# Altium schematic sheet AyaNeoRear_V1.SchDoc
size B; SheetNumber: 1; SheetTotal: 1
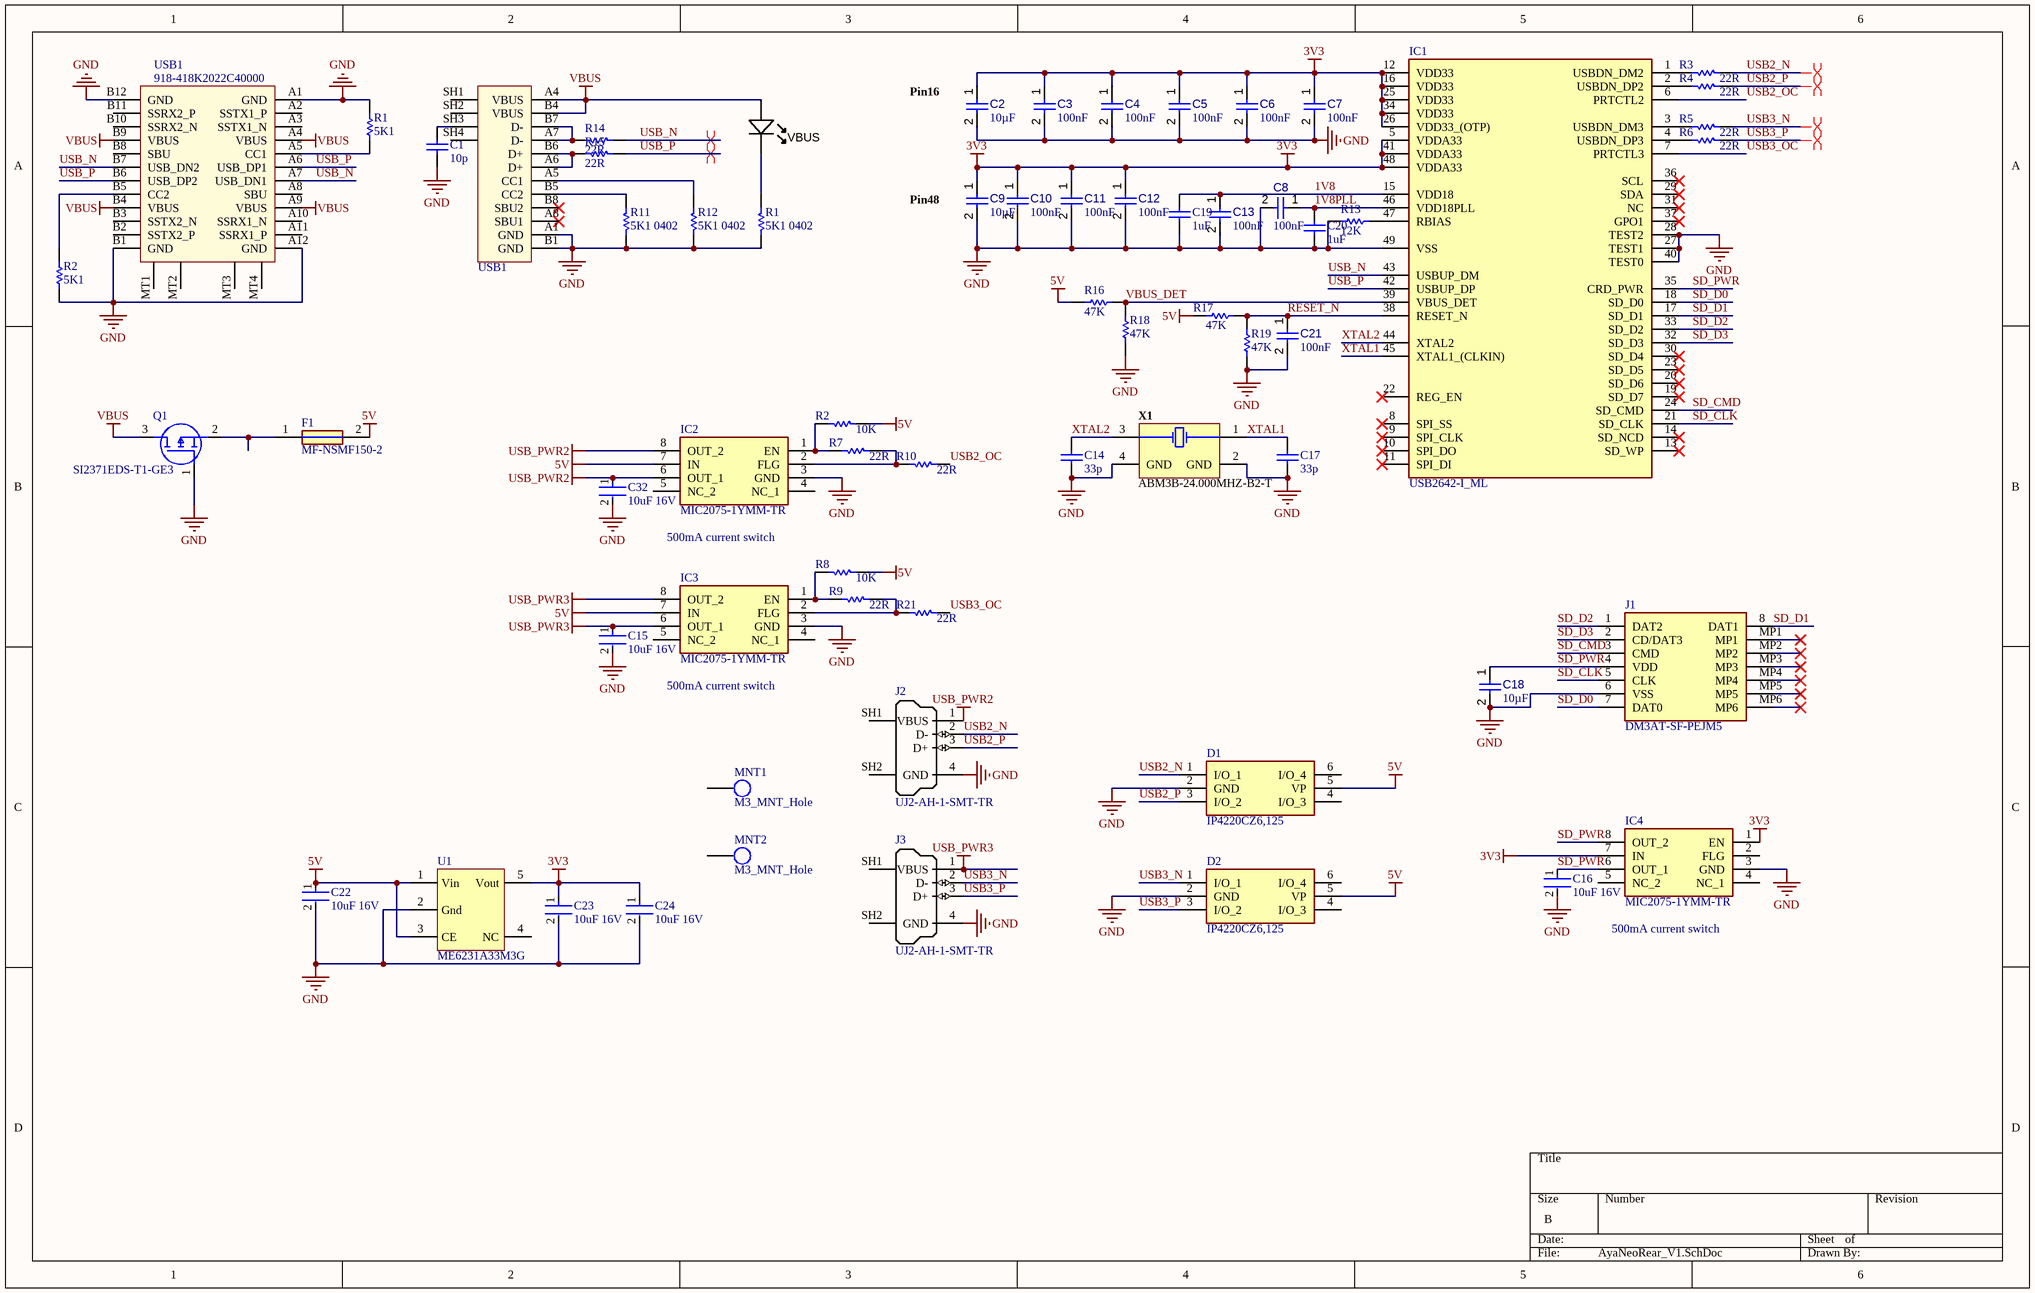
[diagram p0: AyaNeoRear_V1.SchDoc]

## Parts
(Parts that share a designator on the sheet are numbered #1, #2 ... from top to bottom, then left to right.)
C1  10p  [CAPC1005X56X25ML10T15]
C2  value 10µF  [CAPC0603(1608)100_L]  (hidden comment: Capacitor 10µF +/-20% 10V 0603)
C3  value 100nF  [CAPC1005X56X25ML10T15]  (hidden comment: Capacitor 0.1 uF +/- 5% 16 V 0402)
C4  value 100nF  [CAPC1005X56X25ML10T15]  (hidden comment: Capacitor 0.1 uF +/- 5% 16 V 0402)
C5  value 100nF  [CAPC1005X56X25ML10T15]  (hidden comment: Capacitor 0.1 uF +/- 5% 16 V 0402)
C6  value 100nF  [CAPC1005X56X25ML10T15]  (hidden comment: Capacitor 0.1 uF +/- 5% 16 V 0402)
C7  value 100nF  [CAPC1005X56X25ML10T15]  (hidden comment: Capacitor 0.1 uF +/- 5% 16 V 0402)
C8  value 100nF  [CAPC1005X56X25ML10T15]  (hidden comment: Capacitor 0.1 uF +/- 5% 16 V 0402)
C9  value 10µF  [CAPC0603(1608)100_L]  (hidden comment: Capacitor 10µF +/-20% 10V 0603)
C10  value 100nF  [CAPC1005X56X25ML10T15]  (hidden comment: Capacitor 0.1 uF +/- 5% 16 V 0402)
C11  value 100nF  [CAPC1005X56X25ML10T15]  (hidden comment: Capacitor 0.1 uF +/- 5% 16 V 0402)
C12  value 100nF  [CAPC1005X56X25ML10T15]  (hidden comment: Capacitor 0.1 uF +/- 5% 16 V 0402)
C13  value 100nF  [CAPC1005X56X25ML10T15]  (hidden comment: Capacitor 0.1 uF +/- 5% 16 V 0402)
C14  33p  [CAPC1005X56X25ML10T15]
C15  10uF 16V  [FP-CL21-IPC_B]
C16  10uF 16V  [FP-CL21-IPC_B]
C17  33p  [CAPC1005X56X25ML10T15]
C18  value 10µF  [CAPC0603(1608)100_L]  (hidden comment: Capacitor 10µF +/-20% 10V 0603)
C19  1uF  [CAPC1608X90N]
C20  1uF  [CAPC1608X90N]
C21  value 100nF  [CAPC1005X56X25ML10T15]  (hidden comment: Capacitor 0.1 uF +/- 5% 16 V 0402)
C22  10uF 16V  [FP-CL21-IPC_B]
C23  10uF 16V  [FP-CL21-IPC_B]
C24  10uF 16V  [FP-CL21-IPC_B]
C32  10uF 16V  [FP-CL21-IPC_B]
D1  IP4220CZ6,125  [SOT95P275X110-6N]
D2  IP4220CZ6,125  [SOT95P275X110-6N]
F1  MF-NSMF150-2  [FUSC3216X70N]
IC1  USB2642-I_ML  [QFN50P700X700X100-49N-D]
IC2  MIC2075-1YMM-TR  [SOP65P490X110-8N]
IC3  MIC2075-1YMM-TR  [SOP65P490X110-8N]
IC4  MIC2075-1YMM-TR  [SOP65P490X110-8N]
J1  DM3AT-SF-PEJM5  [DM3ATSFPEJM5]
J2  UJ2-AH-1-SMT-TR  [UJ2-AH-1-SMT-TR]
J3  UJ2-AH-1-SMT-TR  [UJ2-AH-1-SMT-TR]
MNT1  M3_MNT_Hole  [M3_MNT_Hole]
MNT2  M3_MNT_Hole  [M3_MNT_Hole]
Q1  SI2371EDS-T1-GE3  [SOT95P237X112-3N]
R1#1  5K1  [RESC1005X40X25ML05T10]  (graphical)
R1#2  5K1 0402  [RESC1005X40X25ML05T05]
R2#1  5K1  [RESC1005X40X25ML05T10]  (graphical)
R2#2  10K  [RESC1005X40X25NL05T05]
R3  22R  [RESC1005X40X25ML05T05]
R4  22R  [RESC1005X40X25ML05T05]
R5  22R  [RESC1005X40X25ML05T05]
R6  22R  [RESC1005X40X25ML05T05]
R7  22R  [RESC1005X40X25ML05T05]
R8  10K  [RESC1005X40X25NL05T05]
R9  22R  [RESC1005X40X25ML05T05]
R10  22R  [RESC1005X40X25ML05T05]
R11  5K1 0402  [RESC1005X40X25ML05T05]
R12  5K1 0402  [RESC1005X40X25ML05T05]
R13  12K  [RESC1005X40X25NL05T05]
R14  22R  [RESC1005X40X25ML05T05]
R15  22R  [RESC1005X40X25ML05T05]
R16  47K  [RESC1005X40X25ML05T10]
R17  47K  [RESC1005X40X25ML05T10]
R18  47K  [RESC1005X40X25ML05T10]
R19  47K  [RESC1005X40X25ML05T10]
R21  22R  [RESC1005X40X25ML05T05]
U1  ME6231A33M3G  [SOT23-5]
USB1#1  USB type C connector  [TYPE-C-31-M-12]  (value not drawn)
USB1#2  918-418K2022C40000  [USB-Type-C 24 contact SMD+THD]  (graphical)
VBUS  LED_Green_GullWing  [LED-0805-A]  (value not drawn)
X1  ABM3B-24.000MHZ-B2-T  [ABRA-ABM3B-4_V]

## Nets
3V3: C2.1 C3.1 C4.1 C5.1 C6.1 C7.1 C9.1 C10.1 C11.1 C12.1 C23.1 C24.1 IC1.5(VDDA33) IC1.12(VDD33) IC1.16(VDD33) IC1.25(VDD33) IC1.26(VDD33_(OTP)) IC1.34(VDD33) IC1.41(VDDA33) IC1.48(VDDA33) IC4.1(EN) IC4.7(IN) U1.5(Vout)
5V: C22.1 D1.5(VP) D2.5(VP) F1.2 IC2.7(IN) IC3.7(IN) R2#2.2 R8.2 R16.2 R17.2 U1.1(Vin) U1.3(CE)
GND: C1.1 C2.2 C3.2 C4.2 C5.2 C6.2 C7.2 C8.2 C9.2 C10.2 C11.2 C12.2 C13.2 C14.2 C15.2 C16.2 C17.2 C18.2 C19.2 C20.2 C21.2 C22.2 C23.2 C24.2 C32.2 D1.2(GND) D2.2(GND) IC1.27(TEST1) IC1.28(TEST2) IC1.40(TEST0) IC1.49(VSS) IC2.3(GND) IC3.3(GND) IC4.3(GND) J1.6(VSS) J2.4(GND) J3.4(GND) Q1.1(G) R1#1.2 R1#2.1 R2#1.1 R11.1 R12.1 R13.2 R18.1 R19.1 U1.2(Gnd) USB1#1.A1(GND) USB1#1.B1(GND) USB1#2.A1(GND) USB1#2.A12(GND) USB1#2.B1(GND) USB1#2.B12(GND) X1.2(GND) X1.4(GND)
USB_PWR2: C32.1 IC2.6(OUT_1) IC2.8(OUT_2) J2.1(VBUS)
USB_PWR3: C15.1 IC3.6(OUT_1) IC3.8(OUT_2) J3.1(VBUS)
VBUS: Q1.3(D) USB1#1.A4(VBUS) USB1#1.B4(VBUS) USB1#2.A4(VBUS) USB1#2.A9(VBUS) USB1#2.B4(VBUS) USB1#2.B9(VBUS) VBUS.A
1V8: C13.1 C19.1 IC1.15(VDD18)
1V8PLL: C8.1 C20.1 IC1.46(VDD18PLL)
RESET_N: C21.1 IC1.38(RESET_N) R17.1 R19.2
SD_CLK: IC1.21(SD_CLK) J1.5(CLK)
SD_CMD: IC1.24(SD_CMD) J1.3(CMD)
SD_D0: IC1.18(SD_D0) J1.7(DAT0)
SD_D1: IC1.17(SD_D1) J1.8(DAT1)
SD_D2: IC1.33(SD_D2) J1.1(DAT2)
SD_D3: IC1.32(SD_D3) J1.2(CD/DAT3)
SD_PWR: C16.1 C18.1 IC1.35(CRD_PWR) IC4.6(OUT_1) IC4.8(OUT_2) J1.4(VDD)
USB2_N: D1.1(I/O_1) J2.2(D-) R3.1
USB2_OC: IC1.6(PRTCTL2) R10.1
USB2_P: D1.3(I/O_2) J2.3(D+) R4.1
USB3_N: D2.1(I/O_1) J3.2(D-) R5.1
USB3_OC: IC1.7(PRTCTL3) R21.1
USB3_P: D2.3(I/O_2) J3.3(D+) R6.1
USB_N: IC1.43(USBUP_DM) R14.1 USB1#2.A7(USB_DN1) USB1#2.B7(USB_DN2)
USB_P: IC1.42(USBUP_DP) R15.1 USB1#2.A6(USB_DP1) USB1#2.B6(USB_DP2)
VBUS_DET: IC1.39(VBUS_DET) R16.1 R18.2
XTAL1: C17.1 IC1.45(XTAL1_(CLKIN)) X1.1(X1)
XTAL2: C14.1 IC1.44(XTAL2) X1.3(X2)
NetC1_2: C1.2 USB1#1.SH3
NetF1_1: F1.1 Q1.2(S)
NetIC1_1: IC1.1(USBDN_DM2) R3.2
NetIC1_2: IC1.2(USBDN_DP2) R4.2
NetIC1_3: IC1.3(USBDN_DM3) R5.2
NetIC1_4: IC1.4(USBDN_DP3) R6.2
NetIC1_47: IC1.47(RBIAS) R13.1
NetIC2_1: IC2.1(EN) R2#2.1 R7.2
NetIC2_2: IC2.2(FLG) R7.1 R10.2
NetIC3_1: IC3.1(EN) R8.1 R9.2
NetIC3_2: IC3.2(FLG) R9.1 R21.2
NetR1#1_1: R1#1.1 USB1#2.A5(CC1)
NetR1#2_2: R1#2.2 VBUS.K
NetR2#1_2: R2#1.2 USB1#2.B5(CC2)
NetR11_2: R11.2 USB1#1.B5(CC2)
NetR12_2: R12.2 USB1#1.A5(CC1)
NetR14_2: R14.2 USB1#1.A7(D-) USB1#1.B7(D-)
NetR15_2: R15.2 USB1#1.A6(D+) USB1#1.B6(D+)

Not connected (* = marked no-connect by the designer): D1 4(I/O_3) 6(I/O_4); D2 4(I/O_3) 6(I/O_4); IC1 8(SPI_SS)* 9(SPI_CLK)* 10(SPI_DO)* 11(SPI_DI)* 13(SD_WP)* 14(SD_NCD)* 19(SD_D7)* 20(SD_D6)* 22(REG_EN)* 23(SD_D5)* 29(SDA)* 30(SD_D4)* 31(NC)* 36(SCL)* 37(GPO1)*; IC2 4(NC_1) 5(NC_2); IC3 4(NC_1) 5(NC_2); IC4 2(FLG) 4(NC_1) 5(NC_2); J1 MP1* MP2* MP3* MP4* MP5* MP6*; J2 SH1(Shell) SH2(Shell); J3 SH1(Shell) SH2(Shell); MNT1 1; MNT2 1; U1 4(NC); USB1#1 A8(SBU1)* B8(SBU2)* SH1 SH2 SH4; USB1#2 A2(SSTX1_P) A3(SSTX1_N) A8(SBU) A10(SSRX1_N) A11(SSRX1_P) B2(SSTX2_P) B3(SSTX2_N) B8(SBU) B10(SSRX2_N) B11(SSRX2_P) MT1 MT2 MT3 MT4

## Layout directives
differential pair: USB2_N, USB2_P, USB3_N, USB3_P, USB_N, USB_P

## Notes on the sheet
- (near C2) Pin16
- (near C9) Pin48
- 500mA current switch

## Library data of the parts
C1 = CMP-2008-02565-1: Manufacturer: AVX Interconnect / Elco; Part Number: 04025A100JAT2A
C2 C9 C18 = CMP-001-00075-2: Chip Capacitor, 10µF +/-20%, 10V, 0603, Thickness 1 mm; Tolerance: 10%; Mounting Technology: SMT; Pins: 2; Min Operating Temperature: -55°C; Case/Package: 0402; Max Operating Temperature: 85°C; Voltage Rating: 10V
C3-C8 C10-C13 C21 = CMP-001-00001-4: Chip Capacitor, 0.1 uF, +/- 5%, 16 V, 0402 (1005 Metric); Voltage Rating: 16V; Capacitor Type: Ceramic; Pins: 2; Min Operating Temperature: -55°C; Mounting Technology: SM; Max Operating Temperature: 125°C; RoHS Compliant: True; Case/Package: 0402; Tolerance: 5%
C14 C17 = CMP-2008-02637-1: 04025A330JAT2A; Manufacturer: AVX Interconnect / Elco; Part Number: 04025A330JAT2A
C15 C16 C22-C24 C32 = CMP-2000-06102-2: CL21 Series 0805 10uF 16V ±10% Tolerance X5R Multilayer Ceramic Chip Capacitor / CL21A106KOQNNNE; Dielectric: X7R; Length: 2mm; Depth: 1.25mm; Voltage: 16V; Width: 0.049inch; Capacitance: 10uF; Lead Free: Lead Free; Max Operating Temperature: 85°C; Mount: Surface Mount; Voltage Rating: 16V; Height: 1.25mm; Radiation Hardening: No; Packaging: Tape and Reel; Voltage Rating (DC): 16V; Thickness: 0.055inch; Case/Package: 0805; Case Code (Imperial): 0805; Min Operating Temperature: -55°C; Case Code (Metric): 2012; Package Quantity: 1; Tolerance: 10%
C19 C20 = GMK107BJ105KA-T: CAP CER 0603 1uF 35V X5R 10%; Value: 1u; Price per 100 unit (LCSC): US$0.0108
D1 D2 = IP4220CZ6,125: Diode; Manufacturer_Name: Nexperia; Datasheet Link: https://assets.nexperia.com/documents/data-sheet/IP4220CZ6.pdf; Height: 1.1mm; Manufacturer_Part_Number: IP4220CZ6,125; Mouser Part Number: 771-IP4220CZ6-T/R; Mouser Price/Stock: https://www.mouser.co.uk/ProductDetail/Nexperia/IP4220CZ6125?qs=me8TqzrmIYWNWIOv4%2FpxMw%3D%3D; Arrow Part Number: IP4220CZ6,125; Arrow Price/Stock: https://www.arrow.com/en/products/ip4220cz6125/nexperia?region=nac
F1 = MF-NSMF150-2: Fuse; Manufacturer_Name: Bourns; Datasheet Link: https://componentsearchengine.com/Datasheets/2/MF-NSMF150-2.pdf; Height: 0.7mm; Manufacturer_Part_Number: MF-NSMF150-2; Mouser Part Number: 652-MF-NSMF150-2; Mouser Price/Stock: https://www.mouser.co.uk/ProductDetail/Bourns/MF-NSMF150-2?qs=7D1gp7DixNnY7uwZYOi52Q%3D%3D; Arrow Part Number: MF-NSMF150-2; Arrow Price/Stock: https://www.arrow.com/en/products/mf-nsmf150-2/bourns?region=nac
IC1 = USB2642-I_ML: Integrated Circuit; Manufacturer_Name: Microchip; Manufacturer_Part_Number: USB2642-I/ML; Datasheet Link: https://www.arrow.com/en/products/usb2642-iml/microchip-technology; Height: 1mm; Mouser Part Number: 579-USB2642-I/ML; Mouser Price/Stock: https://www.mouser.co.uk/ProductDetail/Microchip-Technology/USB2642-I-ML?qs=QaDcGzfVzPPIqPyBH4Ei1Q%3D%3D; Arrow Part Number: USB2642-I/ML; Arrow Price/Stock: https://www.arrow.com/en/products/usb2642-iml/microchip-technology
IC2-IC4 = MIC2075-1YMM-TR: Integrated Circuit; Manufacturer_Name: Microchip; Datasheet Link: https://www.mouser.com/datasheet/2/268/mic2025-779052.pdf; Height: 1.1mm; Manufacturer_Part_Number: MIC2075-1YMM-TR; Mouser Part Number: 998-MIC2075-1YMMTR; Mouser Price/Stock: https://www.mouser.co.uk/ProductDetail/Microchip-Technology-Micrel/MIC2075-1YMM-TR?qs=Y3Q3JoKAO1Rd0m3AZMHE0w%3D%3D
J1 = DM3AT-SF-PEJM5: Connector; Manufacturer_Name: Hirose; Datasheet Link: https://datasheet.lcsc.com/szlcsc/Hirose-HRS-DM3AT-SF-PEJM5_C114218.pdf; Height: 1.83mm; Manufacturer_Part_Number: DM3AT-SF-PEJM5; Mouser Part Number: 798-DM3AT-SF-PEJM5; Mouser Price/Stock: https://www.mouser.co.uk/ProductDetail/Hirose-Connector/DM3AT-SF-PEJM5?qs=LZSZKJVF%252B2WTDKp%252BR7IYAQ%3D%3D
J2 J3 = UJ2-AH-1-SMT-TR: Connector; Manufacturer_Name: CUI Inc.; Datasheet Link: http://www.cui.com/product/resource/uj2-ah-smt.pdf; Manufacturer_Part_Number: UJ2-AH-1-SMT-TR; Mouser Part Number: 490-UJ2-AH-1-SMT-TR; Mouser Price/Stock: https://www.mouser.co.uk/ProductDetail/CUI-Devices/UJ2-AH-1-SMT-TR?qs=%2FacZuiyY%252B4bMRuKlU7nMjQ%3D%3D; Arrow Part Number: UJ2-AH-1-SMT-TR; Arrow Price/Stock: https://www.arrow.com/en/products/uj2-ah-1-smt-tr/cui-devices
Q1 = SI2371EDS-T1-GE3: MOSFET (P-Channel); Manufacturer_Name: Vishay; Datasheet Link: http://www.vishay.com/docs/63924/si2371eds.pdf; Height: 1.12mm; Manufacturer_Part_Number: SI2371EDS-T1-GE3; Mouser Part Number: 78-SI2371EDS-T1-GE3; Mouser Price/Stock: https://www.mouser.co.uk/ProductDetail/Vishay-Semiconductors/SI2371EDS-T1-GE3?qs=vgn07B5hXatICifqRPHaiw%3D%3D; Arrow Part Number: SI2371EDS-T1-GE3; Arrow Price/Stock: https://www.arrow.com/en/products/si2371eds-t1-ge3/vishay?region=nac
R1#1 R2#1 = CMP-2002-07753-1: RC0402FR-075K1L; Manufacturer: Yageo / Phycomp; Part Number: RC0402FR-075K1L
R1#2 R11 R12 = CMP-2002-01158-1: ERJ-2RKF5101X; Manufacturer: Panasonic; Part Number: ERJ-2RKF5101X
R2#2 R8 = CMP-2002-08135-1: CRCW040210K0FKED; Manufacturer: Vishay Dale; Part Number: CRCW040210K0FKED
R3-R7 R9 R10 R14 R15 R21 = CMP-2002-01135-4: ERJ-2RKF22R0X / Chip Resistor, 22 Ohm, +/- 1%, 0.1 W, -55 to 155 degC, 0402 (1005 Metric), RoHS, Tape and Reel; Case\/Package: 0402; Resistance: 22 Ohm; Power Rating: 100 mW; Voltage Rating: 50 V; ComponentLink2Description: Datasheet; PartNumber: ERJ-2RKF22R0X; Packaging: Tape and Reel; Weight: 2.8E-05oz; Pins: 2; Case Code (Imperial): 0402; Width: 0.5 mm; ComponentLink2URL: http://industrial.panasonic.com/cdbs/www-data/pdf/RDA0000/AOA0000C86.pdf; Height: 0.35 mm; PackageReference: 0402; REACH SVHC: Yes; Min Operating Temperature: -55 degC; Length: 1 mm; DatasheetVersion: 04/2015; RoHSCompliant: true; Package Quantity: 10000; Case Code (Metric): 1005; PackageDescription: 2-Pin Surface Mount Device, Body 1 x 0.5 mm; ComponentLink1URL: http://www.panasonic.com/; Mount: Surface Mount; Mounting Technology: Surface Mount; Tolerance: 1%; Max Operating Temperature: 155 degC; ComponentLink1Description: Manufacturer URL
R13 = CMP-1011-00631-2: CRCW040212K0FKED; Manufacturer: Vishay Dale; Part Number: CRCW040212K0FKED
R16-R19 = CMP-2002-07701-1: RC0402FR-0747KL; Manufacturer: Yageo / Phycomp; Part Number: RC0402FR-0747KL
U1 = CMP-019-00053-1: Linear Voltage Regulator IC, 3.3V Fixed Output, 500mA, SOT-23-5; Dropout voltage @100mA Iout: 125mV; Operation input voltage range: 3V - 18V; Ripple rejection @1kHz: 65dB; Output voltage: 3.3V
USB1#1 = USB_Type_C: ComponentLink1Description: Datasheet; ComponentLink1URL: https://lcsc.com/product-detail/USB-Type-C_Korean-Hroparts-Elec-TYPE-C-31-M-12_C165948.html
USB1#2 = Type_C_24P_SMD_THT: ComponentLink1Description: LCSC; ComponentLink1URL: https://lcsc.com/product-detail/span-style-background-color-ff0-USB-span-Connectors_Jing-Extension-of-the-Electronic-Co-918-418K2022C40000_C168700.html
VBUS = LED_Green_GullWing: LED Gull-wing SMD High-intensity Green 450mcd 574nm; Manufacturer 1: Ligitek; Manufacturer Part Number 1: L8UG9033/TR1; Ratings: 450 mcd; 574 nm; SCDType: source; Package / Case: 4.6mm Gull-Wing; Material: AlGaInP; Color: Green
X1 = CMP-1688-00008-1: Ceramic SMD Crystal, 24 MHz, +/- 20 ppm, 50 Ohm, -20 to 70 degC, 4-Pin SMD, RoHS, Tape and Reel; Impedance: 50 Ohm; Mating Cycles: 30; Frequency: 6 Hz; Contact Material: Brass; Contact Plating: Gold; PackageReference: ABM3B; Min Operating Temperature: -40 degC; ComponentLink2Description: Datasheet; Radiation Hardening: No; DatasheetVersion: Aug-15; Packaging: Tape and Reel; Length: 2.6 mm; Package Quantity: 2500; REACH SVHC: Unknown; PackageDescription: 4-Pin Surface Mount Device, Body 5 x 3.2 mm; Weight: 0.001058 oz; ComponentLink2URL: http://www.abracon.com/Resonators/abm3b.pdf; ComponentLink1Description: Manufacturer URL; Width: 3 mm; RoHSCompliant: true; Fastening Type: Snap; Max Operating Temperature: 155 degC; ComponentLink1URL: http://www.abracon.com/; Height: 1.244 mm; Mount: Surface Mount